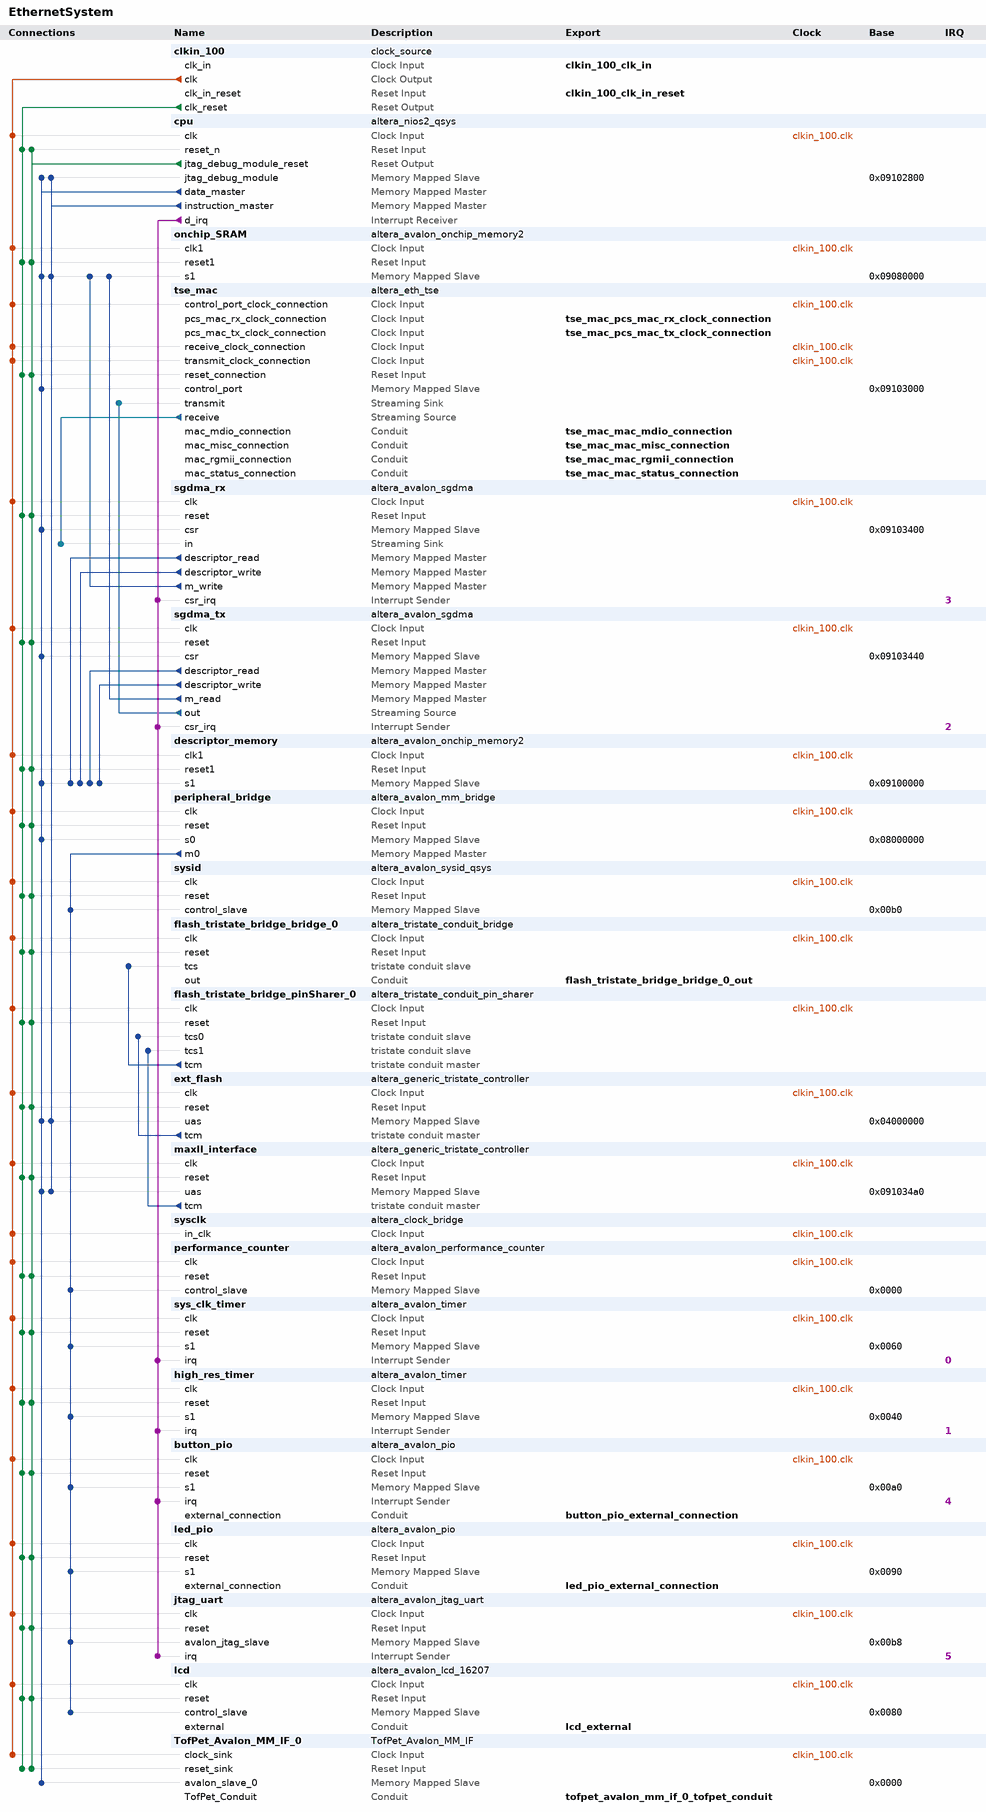
[diagram p0: system contents]
# Platform Designer (Qsys) system EthernetSystem, Arria II GX EP2AGX125EF35C4
# Parameters at their usual value, and those the tool derives, are not listed.
package require -exact qsys 13.0.1.99.2
create_system EthernetSystem
set_project_property DEVICE_FAMILY {Arria II GX}
set_project_property DEVICE EP2AGX125EF35C4

add_instance clkin_100 clock_source 13.0
set_instance_parameter_value clkin_100 clockFrequency 100000000

add_instance cpu altera_nios2_qsys 13.0
set_instance_parameter_value cpu muldiv_divider true
set_instance_parameter_value cpu mmu_autoAssignTlbPtrSz false
set_instance_parameter_value cpu manuallyAssignCpuID false
set_instance_parameter_value cpu resetOffset 33685504
set_instance_parameter_value cpu exceptionOffset 288
set_instance_parameter_value cpu resetSlave ext_flash.uas
set_instance_parameter_value cpu exceptionSlave onchip_SRAM.s1
set_instance_parameter_value cpu breakSlave cpu.jtag_debug_module
set_instance_parameter_value cpu muldiv_multiplierType DSPBlock
set_instance_parameter_value cpu impl Fast
set_instance_parameter_value cpu icache_size 32768
set_instance_parameter_value cpu dcache_size 32768

add_instance onchip_SRAM altera_avalon_onchip_memory2 13.0.1.99.2
set_instance_parameter_value onchip_SRAM dataWidth 32
set_instance_parameter_value onchip_SRAM dualPort false
set_instance_parameter_value onchip_SRAM initMemContent true
set_instance_parameter_value onchip_SRAM initializationFileName onchip_mem.hex
set_instance_parameter_value onchip_SRAM memorySize 524288

add_instance tse_mac altera_eth_tse 13.0
set_instance_parameter_value tse_mac core_variation MAC_ONLY
set_instance_parameter_value tse_mac ifGMII RGMII
set_instance_parameter_value tse_mac transceiver_type NONE
set_instance_parameter_value tse_mac enable_hd_logic true
set_instance_parameter_value tse_mac enable_gmii_loopback true
set_instance_parameter_value tse_mac enable_sup_addr true
set_instance_parameter_value tse_mac stat_cnt_ena true
set_instance_parameter_value tse_mac enable_shift16 true
set_instance_parameter_value tse_mac enable_mac_flow_ctrl true
set_instance_parameter_value tse_mac enable_mac_vlan true
set_instance_parameter_value tse_mac enable_magic_detect true
set_instance_parameter_value tse_mac mdio_clk_div 40
set_instance_parameter_value tse_mac ing_addr 11

add_instance sgdma_rx altera_avalon_sgdma 13.0.1.99.2
set_instance_parameter_value sgdma_rx enableBurstTransfers false
set_instance_parameter_value sgdma_rx enableUnalignedTransfers false
set_instance_parameter_value sgdma_rx readBlockDataWidth 32
set_instance_parameter_value sgdma_rx sinkErrorWidth 6
set_instance_parameter_value sgdma_rx sourceErrorWidth 0
set_instance_parameter_value sgdma_rx transferMode STREAM_TO_MEMORY
set_instance_parameter_value sgdma_rx writeBurstcountWidth 4

add_instance sgdma_tx altera_avalon_sgdma 13.0.1.99.2
set_instance_parameter_value sgdma_tx enableBurstTransfers false
set_instance_parameter_value sgdma_tx enableUnalignedTransfers false
set_instance_parameter_value sgdma_tx readBlockDataWidth 32
set_instance_parameter_value sgdma_tx sinkErrorWidth 0
set_instance_parameter_value sgdma_tx sourceErrorWidth 1
set_instance_parameter_value sgdma_tx transferMode MEMORY_TO_STREAM
set_instance_parameter_value sgdma_tx writeBurstcountWidth 4

add_instance descriptor_memory altera_avalon_onchip_memory2 13.0.1.99.2
set_instance_parameter_value descriptor_memory dataWidth 32
set_instance_parameter_value descriptor_memory dualPort false
set_instance_parameter_value descriptor_memory initMemContent true
set_instance_parameter_value descriptor_memory initializationFileName descriptor_memory
set_instance_parameter_value descriptor_memory memorySize 8192

add_instance peripheral_bridge altera_avalon_mm_bridge 13.0
set_instance_parameter_value peripheral_bridge DATA_WIDTH 32
set_instance_parameter_value peripheral_bridge ADDRESS_WIDTH 8
set_instance_parameter_value peripheral_bridge ADDRESS_UNITS SYMBOLS
set_instance_parameter_value peripheral_bridge MAX_PENDING_RESPONSES 3

add_instance sysid altera_avalon_sysid_qsys 13.0
set_instance_parameter_value sysid id 0

add_instance flash_tristate_bridge_bridge_0 altera_tristate_conduit_bridge 13.0

add_instance flash_tristate_bridge_pinSharer_0 altera_tristate_conduit_pin_sharer 13.0
set_instance_parameter_value flash_tristate_bridge_pinSharer_0 NUM_INTERFACES 2
set_instance_parameter_value flash_tristate_bridge_pinSharer_0 MODULE_ORIGIN_LIST maxII_interface.tcm,maxII_interface.tcm,maxII_interface.tcm,maxII_interface.tcm,maxII_interface.tcm,maxII_interface.tcm,ext_flash.tcm,ext_flash.tcm,ext_flash.tcm,ext_flash.tcm,ext_flash.tcm
set_instance_parameter_value flash_tristate_bridge_pinSharer_0 SIGNAL_ORIGIN_LIST address,byteenable_n,read_n,write_n,data,chipselect_n,address,read_n,write_n,data,chipselect_n
set_instance_parameter_value flash_tristate_bridge_pinSharer_0 SHARED_SIGNAL_LIST flash_tristate_bridge_address,be_n_to_the_maxII_interface,oe_n_to_the_maxII_interface,we_n_to_the_maxII_interface,flash_tristate_bridge_data,cs_n_to_the_maxII_interface,flash_tristate_bridge_address,read_n_to_the_ext_flash,write_n_to_the_ext_flash,flash_tristate_bridge_data,select_n_to_the_ext_flash

add_instance ext_flash altera_generic_tristate_controller 13.0
set_instance_parameter_value ext_flash TCM_ADDRESS_W 26
set_instance_parameter_value ext_flash TCM_DATA_W 16
set_instance_parameter_value ext_flash TCM_BYTEENABLE_W 2
set_instance_parameter_value ext_flash TCM_READ_WAIT 110
set_instance_parameter_value ext_flash TCM_WRITE_WAIT 110
set_instance_parameter_value ext_flash TCM_SETUP_WAIT 25
set_instance_parameter_value ext_flash TCM_DATA_HOLD 20
set_instance_parameter_value ext_flash TCM_MAX_PENDING_READ_TRANSACTIONS 3
set_instance_parameter_value ext_flash TCM_TURNAROUND_TIME 2
set_instance_parameter_value ext_flash TCM_TIMING_UNITS 0
set_instance_parameter_value ext_flash TCM_READLATENCY 2
set_instance_parameter_value ext_flash TCM_SYMBOLS_PER_WORD 2
set_instance_parameter_value ext_flash USE_READ 1
set_instance_parameter_value ext_flash USE_BEGINTRANSFER 0
set_instance_parameter_value ext_flash USE_BYTEENABLE 0
set_instance_parameter_value ext_flash USE_OUTPUTENABLE 0
set_instance_parameter_value ext_flash ACTIVE_LOW_READ 1
set_instance_parameter_value ext_flash ACTIVE_LOW_BYTEENABLE 0
set_instance_parameter_value ext_flash ACTIVE_LOW_OUTPUTENABLE 0
set_instance_parameter_value ext_flash ACTIVE_LOW_BEGINTRANSFER 0
set_instance_parameter_value ext_flash CHIPSELECT_THROUGH_READLATENCY 0
set_instance_parameter_value ext_flash MODULE_ASSIGNMENT_KEYS embeddedsw.configuration.hwClassnameDriverSupportList,embeddedsw.configuration.hwClassnameDriverSupportDefault,embeddedsw.CMacro.SETUP_VALUE,embeddedsw.CMacro.WAIT_VALUE,embeddedsw.CMacro.HOLD_VALUE,embeddedsw.CMacro.TIMING_UNITS,embeddedsw.CMacro.SIZE,embeddedsw.memoryInfo.MEM_INIT_DATA_WIDTH,embeddedsw.memoryInfo.HAS_BYTE_LANE,embeddedsw.memoryInfo.IS_FLASH,embeddedsw.memoryInfo.GENERATE_DAT_SYM,embeddedsw.memoryInfo.GENERATE_FLASH,embeddedsw.memoryInfo.DAT_SYM_INSTALL_DIR,embeddedsw.memoryInfo.FLASH_INSTALL_DIR
set_instance_parameter_value ext_flash MODULE_ASSIGNMENT_VALUES {altera_avalon_lan91c111:altera_avalon_cfi_flash,altera_avalon_cfi_flash,25,110,20,"ns",67108864u,16,1,1,1,1,SIM_DIR,APP_DIR}
set_instance_parameter_value ext_flash INTERFACE_ASSIGNMENT_KEYS embeddedsw.configuration.isFlash,embeddedsw.configuration.isMemoryDevice,embeddedsw.configuration.isNonVolatileStorage
set_instance_parameter_value ext_flash INTERFACE_ASSIGNMENT_VALUES 1,1,1

add_instance maxII_interface altera_generic_tristate_controller 13.0
set_instance_parameter_value maxII_interface TCM_ADDRESS_W 5
set_instance_parameter_value maxII_interface TCM_DATA_W 32
set_instance_parameter_value maxII_interface TCM_BYTEENABLE_W 4
set_instance_parameter_value maxII_interface TCM_READ_WAIT 100
set_instance_parameter_value maxII_interface TCM_WRITE_WAIT 100
set_instance_parameter_value maxII_interface TCM_SETUP_WAIT 0
set_instance_parameter_value maxII_interface TCM_DATA_HOLD 0
set_instance_parameter_value maxII_interface TCM_MAX_PENDING_READ_TRANSACTIONS 3
set_instance_parameter_value maxII_interface TCM_TURNAROUND_TIME 2
set_instance_parameter_value maxII_interface TCM_TIMING_UNITS 0
set_instance_parameter_value maxII_interface TCM_READLATENCY 2
set_instance_parameter_value maxII_interface TCM_SYMBOLS_PER_WORD 4
set_instance_parameter_value maxII_interface USE_READ 1
set_instance_parameter_value maxII_interface USE_BEGINTRANSFER 0
set_instance_parameter_value maxII_interface USE_BYTEENABLE 1
set_instance_parameter_value maxII_interface USE_OUTPUTENABLE 0
set_instance_parameter_value maxII_interface ACTIVE_LOW_READ 1
set_instance_parameter_value maxII_interface ACTIVE_LOW_BYTEENABLE 1
set_instance_parameter_value maxII_interface ACTIVE_LOW_OUTPUTENABLE 0
set_instance_parameter_value maxII_interface ACTIVE_LOW_BEGINTRANSFER 0
set_instance_parameter_value maxII_interface CHIPSELECT_THROUGH_READLATENCY 0
set_instance_parameter_value maxII_interface IS_MEMORY_DEVICE 0
set_instance_parameter_value maxII_interface MODULE_ASSIGNMENT_KEYS embeddedsw.configuration.hwClassnameDriverSupportList,embeddedsw.configuration.hwClassnameDriverSupportDefault
set_instance_parameter_value maxII_interface MODULE_ASSIGNMENT_VALUES altera_avalon_lan91c111:altera_avalon_cfi_flash,maxII_interface
set_instance_parameter_value maxII_interface INTERFACE_ASSIGNMENT_KEYS embeddedsw.configuration.isFlash,embeddedsw.configuration.isMemoryDevice,embeddedsw.configuration.isNonVolatileStorage,embeddedsw.configuration.isPrintableDevice
set_instance_parameter_value maxII_interface INTERFACE_ASSIGNMENT_VALUES 0,0,0,0

add_instance sysclk altera_clock_bridge 13.0
set_instance_parameter_value sysclk DERIVED_CLOCK_RATE 100000000
set_instance_parameter_value sysclk EXPLICIT_CLOCK_RATE 0

add_instance performance_counter altera_avalon_performance_counter 13.0.1.99.2
set_instance_parameter_value performance_counter numberOfSections 3

add_instance sys_clk_timer altera_avalon_timer 13.0.1.99.2
set_instance_parameter_value sys_clk_timer period 10
set_instance_parameter_value sys_clk_timer periodUnits MSEC

add_instance high_res_timer altera_avalon_timer 13.0.1.99.2
set_instance_parameter_value high_res_timer period 10
set_instance_parameter_value high_res_timer periodUnits USEC

add_instance button_pio altera_avalon_pio 13.0.1.99.2
set_instance_parameter_value button_pio captureEdge true
set_instance_parameter_value button_pio direction Input
set_instance_parameter_value button_pio edgeType ANY
set_instance_parameter_value button_pio generateIRQ true
set_instance_parameter_value button_pio irqType EDGE
set_instance_parameter_value button_pio simDoTestBenchWiring true
set_instance_parameter_value button_pio width 2

add_instance led_pio altera_avalon_pio 13.0.1.99.2
set_instance_parameter_value led_pio direction Output
set_instance_parameter_value led_pio width 4

add_instance jtag_uart altera_avalon_jtag_uart 13.0.1.99.2
set_instance_parameter_value jtag_uart simInteractiveOptions INTERACTIVE_ASCII_OUTPUT

add_instance lcd altera_avalon_lcd_16207 13.0.1.99.2

add_instance TofPet_Avalon_MM_IF_0 TofPet_Avalon_MM_IF 1.0

# connections
add_connection clkin_100.clk button_pio.clk clock
add_connection clkin_100.clk cpu.clk clock
add_connection clkin_100.clk descriptor_memory.clk1 clock
add_connection clkin_100.clk ext_flash.clk clock
add_connection clkin_100.clk flash_tristate_bridge_bridge_0.clk clock
add_connection clkin_100.clk flash_tristate_bridge_pinSharer_0.clk clock
add_connection clkin_100.clk high_res_timer.clk clock
add_connection clkin_100.clk jtag_uart.clk clock
add_connection clkin_100.clk lcd.clk clock
add_connection clkin_100.clk led_pio.clk clock
add_connection clkin_100.clk maxII_interface.clk clock
add_connection clkin_100.clk onchip_SRAM.clk1 clock
add_connection clkin_100.clk performance_counter.clk clock
add_connection clkin_100.clk peripheral_bridge.clk clock
add_connection clkin_100.clk sgdma_rx.clk clock
add_connection clkin_100.clk sgdma_tx.clk clock
add_connection clkin_100.clk sys_clk_timer.clk clock
add_connection clkin_100.clk sysclk.in_clk clock
add_connection clkin_100.clk sysid.clk clock
add_connection clkin_100.clk TofPet_Avalon_MM_IF_0.clock_sink clock
add_connection clkin_100.clk tse_mac.control_port_clock_connection clock
add_connection clkin_100.clk tse_mac.receive_clock_connection clock
add_connection clkin_100.clk tse_mac.transmit_clock_connection clock
add_connection clkin_100.clk_reset button_pio.reset reset
add_connection clkin_100.clk_reset cpu.reset_n reset
add_connection clkin_100.clk_reset descriptor_memory.reset1 reset
add_connection clkin_100.clk_reset ext_flash.reset reset
add_connection clkin_100.clk_reset flash_tristate_bridge_bridge_0.reset reset
add_connection clkin_100.clk_reset flash_tristate_bridge_pinSharer_0.reset reset
add_connection clkin_100.clk_reset high_res_timer.reset reset
add_connection clkin_100.clk_reset jtag_uart.reset reset
add_connection clkin_100.clk_reset lcd.reset reset
add_connection clkin_100.clk_reset led_pio.reset reset
add_connection clkin_100.clk_reset maxII_interface.reset reset
add_connection clkin_100.clk_reset onchip_SRAM.reset1 reset
add_connection clkin_100.clk_reset performance_counter.reset reset
add_connection clkin_100.clk_reset peripheral_bridge.reset reset
add_connection clkin_100.clk_reset sgdma_rx.reset reset
add_connection clkin_100.clk_reset sgdma_tx.reset reset
add_connection clkin_100.clk_reset sys_clk_timer.reset reset
add_connection clkin_100.clk_reset sysid.reset reset
add_connection clkin_100.clk_reset TofPet_Avalon_MM_IF_0.reset_sink reset
add_connection clkin_100.clk_reset tse_mac.reset_connection reset
add_connection cpu.jtag_debug_module_reset button_pio.reset reset
add_connection cpu.jtag_debug_module_reset cpu.reset_n reset
add_connection cpu.jtag_debug_module_reset descriptor_memory.reset1 reset
add_connection cpu.jtag_debug_module_reset ext_flash.reset reset
add_connection cpu.jtag_debug_module_reset flash_tristate_bridge_bridge_0.reset reset
add_connection cpu.jtag_debug_module_reset flash_tristate_bridge_pinSharer_0.reset reset
add_connection cpu.jtag_debug_module_reset high_res_timer.reset reset
add_connection cpu.jtag_debug_module_reset jtag_uart.reset reset
add_connection cpu.jtag_debug_module_reset lcd.reset reset
add_connection cpu.jtag_debug_module_reset led_pio.reset reset
add_connection cpu.jtag_debug_module_reset maxII_interface.reset reset
add_connection cpu.jtag_debug_module_reset onchip_SRAM.reset1 reset
add_connection cpu.jtag_debug_module_reset performance_counter.reset reset
add_connection cpu.jtag_debug_module_reset peripheral_bridge.reset reset
add_connection cpu.jtag_debug_module_reset sgdma_rx.reset reset
add_connection cpu.jtag_debug_module_reset sgdma_tx.reset reset
add_connection cpu.jtag_debug_module_reset sys_clk_timer.reset reset
add_connection cpu.jtag_debug_module_reset sysid.reset reset
add_connection cpu.jtag_debug_module_reset TofPet_Avalon_MM_IF_0.reset_sink reset
add_connection cpu.jtag_debug_module_reset tse_mac.reset_connection reset
add_connection cpu.data_master cpu.jtag_debug_module avalon
set_connection_parameter_value cpu.data_master/cpu.jtag_debug_module baseAddress 0x09102800
add_connection cpu.data_master descriptor_memory.s1 avalon
set_connection_parameter_value cpu.data_master/descriptor_memory.s1 baseAddress 0x09100000
add_connection cpu.data_master ext_flash.uas avalon
set_connection_parameter_value cpu.data_master/ext_flash.uas baseAddress 0x04000000
add_connection cpu.data_master maxII_interface.uas avalon
set_connection_parameter_value cpu.data_master/maxII_interface.uas baseAddress 0x091034a0
add_connection cpu.data_master onchip_SRAM.s1 avalon
set_connection_parameter_value cpu.data_master/onchip_SRAM.s1 baseAddress 0x09080000
add_connection cpu.data_master peripheral_bridge.s0 avalon
set_connection_parameter_value cpu.data_master/peripheral_bridge.s0 baseAddress 0x08000000
add_connection cpu.data_master sgdma_rx.csr avalon
set_connection_parameter_value cpu.data_master/sgdma_rx.csr baseAddress 0x09103400
add_connection cpu.data_master sgdma_tx.csr avalon
set_connection_parameter_value cpu.data_master/sgdma_tx.csr baseAddress 0x09103440
add_connection cpu.data_master TofPet_Avalon_MM_IF_0.avalon_slave_0 avalon
set_connection_parameter_value cpu.data_master/TofPet_Avalon_MM_IF_0.avalon_slave_0 baseAddress 0x0000
add_connection cpu.data_master tse_mac.control_port avalon
set_connection_parameter_value cpu.data_master/tse_mac.control_port baseAddress 0x09103000
add_connection cpu.instruction_master cpu.jtag_debug_module avalon
set_connection_parameter_value cpu.instruction_master/cpu.jtag_debug_module baseAddress 0x09102800
add_connection cpu.instruction_master ext_flash.uas avalon
set_connection_parameter_value cpu.instruction_master/ext_flash.uas baseAddress 0x04000000
add_connection cpu.instruction_master maxII_interface.uas avalon
set_connection_parameter_value cpu.instruction_master/maxII_interface.uas baseAddress 0x091034a0
add_connection cpu.instruction_master onchip_SRAM.s1 avalon
set_connection_parameter_value cpu.instruction_master/onchip_SRAM.s1 baseAddress 0x09080000
add_connection peripheral_bridge.m0 button_pio.s1 avalon
set_connection_parameter_value peripheral_bridge.m0/button_pio.s1 baseAddress 0x00a0
add_connection peripheral_bridge.m0 high_res_timer.s1 avalon
set_connection_parameter_value peripheral_bridge.m0/high_res_timer.s1 baseAddress 0x0040
add_connection peripheral_bridge.m0 jtag_uart.avalon_jtag_slave avalon
set_connection_parameter_value peripheral_bridge.m0/jtag_uart.avalon_jtag_slave baseAddress 0x00b8
add_connection peripheral_bridge.m0 lcd.control_slave avalon
set_connection_parameter_value peripheral_bridge.m0/lcd.control_slave baseAddress 0x0080
add_connection peripheral_bridge.m0 led_pio.s1 avalon
set_connection_parameter_value peripheral_bridge.m0/led_pio.s1 baseAddress 0x0090
add_connection peripheral_bridge.m0 performance_counter.control_slave avalon
set_connection_parameter_value peripheral_bridge.m0/performance_counter.control_slave baseAddress 0x0000
add_connection peripheral_bridge.m0 sys_clk_timer.s1 avalon
set_connection_parameter_value peripheral_bridge.m0/sys_clk_timer.s1 baseAddress 0x0060
add_connection peripheral_bridge.m0 sysid.control_slave avalon
set_connection_parameter_value peripheral_bridge.m0/sysid.control_slave baseAddress 0x00b0
add_connection sgdma_rx.descriptor_read descriptor_memory.s1 avalon
set_connection_parameter_value sgdma_rx.descriptor_read/descriptor_memory.s1 baseAddress 0x09100000
add_connection sgdma_rx.descriptor_write descriptor_memory.s1 avalon
set_connection_parameter_value sgdma_rx.descriptor_write/descriptor_memory.s1 baseAddress 0x09100000
add_connection sgdma_rx.m_write onchip_SRAM.s1 avalon
set_connection_parameter_value sgdma_rx.m_write/onchip_SRAM.s1 baseAddress 0x09080000
add_connection sgdma_tx.descriptor_read descriptor_memory.s1 avalon
set_connection_parameter_value sgdma_tx.descriptor_read/descriptor_memory.s1 baseAddress 0x09100000
add_connection sgdma_tx.descriptor_write descriptor_memory.s1 avalon
set_connection_parameter_value sgdma_tx.descriptor_write/descriptor_memory.s1 baseAddress 0x09100000
add_connection sgdma_tx.m_read onchip_SRAM.s1 avalon
set_connection_parameter_value sgdma_tx.m_read/onchip_SRAM.s1 baseAddress 0x09080000
add_connection sgdma_tx.out tse_mac.transmit avalon_streaming
add_connection tse_mac.receive sgdma_rx.in avalon_streaming
add_connection cpu.d_irq button_pio.irq interrupt
set_connection_parameter_value cpu.d_irq/button_pio.irq irqNumber 4
add_connection cpu.d_irq high_res_timer.irq interrupt
set_connection_parameter_value cpu.d_irq/high_res_timer.irq irqNumber 1
add_connection cpu.d_irq jtag_uart.irq interrupt
set_connection_parameter_value cpu.d_irq/jtag_uart.irq irqNumber 5
add_connection cpu.d_irq sgdma_rx.csr_irq interrupt
set_connection_parameter_value cpu.d_irq/sgdma_rx.csr_irq irqNumber 3
add_connection cpu.d_irq sgdma_tx.csr_irq interrupt
set_connection_parameter_value cpu.d_irq/sgdma_tx.csr_irq irqNumber 2
add_connection cpu.d_irq sys_clk_timer.irq interrupt
set_connection_parameter_value cpu.d_irq/sys_clk_timer.irq irqNumber 0
add_connection ext_flash.tcm flash_tristate_bridge_pinSharer_0.tcs0 tristate_conduit
add_connection flash_tristate_bridge_pinSharer_0.tcm flash_tristate_bridge_bridge_0.tcs tristate_conduit
add_connection maxII_interface.tcm flash_tristate_bridge_pinSharer_0.tcs1 tristate_conduit

# exported interfaces
add_interface lcd_external conduit end
set_interface_property lcd_external EXPORT_OF lcd.external
add_interface flash_tristate_bridge_bridge_0_out conduit end
set_interface_property flash_tristate_bridge_bridge_0_out EXPORT_OF flash_tristate_bridge_bridge_0.out
add_interface clkin_100_clk_in_reset reset sink
set_interface_property clkin_100_clk_in_reset EXPORT_OF clkin_100.clk_in_reset
add_interface led_pio_external_connection conduit end
set_interface_property led_pio_external_connection EXPORT_OF led_pio.external_connection
add_interface clkin_100_clk_in clock sink
set_interface_property clkin_100_clk_in EXPORT_OF clkin_100.clk_in
add_interface button_pio_external_connection conduit end
set_interface_property button_pio_external_connection EXPORT_OF button_pio.external_connection
add_interface tse_mac_mac_status_connection conduit end
set_interface_property tse_mac_mac_status_connection EXPORT_OF tse_mac.mac_status_connection
add_interface tse_mac_mac_rgmii_connection conduit end
set_interface_property tse_mac_mac_rgmii_connection EXPORT_OF tse_mac.mac_rgmii_connection
add_interface tse_mac_mac_mdio_connection conduit end
set_interface_property tse_mac_mac_mdio_connection EXPORT_OF tse_mac.mac_mdio_connection
add_interface tse_mac_mac_misc_connection conduit end
set_interface_property tse_mac_mac_misc_connection EXPORT_OF tse_mac.mac_misc_connection
add_interface tse_mac_pcs_mac_tx_clock_connection clock sink
set_interface_property tse_mac_pcs_mac_tx_clock_connection EXPORT_OF tse_mac.pcs_mac_tx_clock_connection
add_interface tse_mac_pcs_mac_rx_clock_connection clock sink
set_interface_property tse_mac_pcs_mac_rx_clock_connection EXPORT_OF tse_mac.pcs_mac_rx_clock_connection
add_interface tofpet_avalon_mm_if_0_tofpet_conduit conduit end
set_interface_property tofpet_avalon_mm_if_0_tofpet_conduit EXPORT_OF TofPet_Avalon_MM_IF_0.TofPet_Conduit

set_interconnect_requirement {$system} qsys_mm.clockCrossingAdapter HANDSHAKE
set_interconnect_requirement {$system} qsys_mm.maxAdditionalLatency 0

save_system EthernetSystem.qsys
